# Altium project Breakout_for_ics4343.PrjPcb
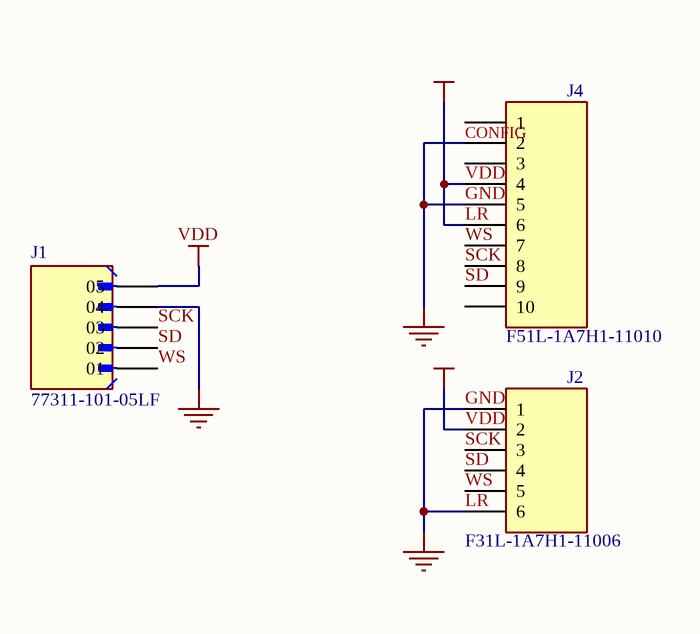
[diagram p0: Breakout_for_ics4343.SchDoc]
1 sheet, 3 parts. Net scope: global (net labels, ports and power ports of the same name join across sheets).
Board file: Breakout_for_ics4343.PcbDoc

## Sheet Breakout_for_ics4343.SchDoc
size 149 x 90 mm; SheetNumber: 1; SheetTotal: 1

### Parts
J1  77311-101-05LF  [AMPHENOL_77311-101-05LF]
J2  F31L-1A7H1-11006  [AMPHENOL_F31L-1A7H1-11006]
J4  F51L-1A7H1-11010  [AMPHENOL_F51L-1A7H1-11010]

### Nets
GND: J1.04 J2.1 J2.6 J4.2 J4.5
VDD: J1.05 J2.2 J4.4 J4.6
SCK: J1.03 J2.3 J4.8
SD: J1.02 J2.4 J4.9
WS: J1.01 J2.5 J4.7

Not connected (* = marked no-connect by the designer): J4 1 3 10

### Notes on the sheet
- (near J4) CONFIG
- (near J4) LR
- (near J4) VDD
- (near J4) GND
- (near J2) VDD
- (near J2) GND
- (near J2) LR

### Library data of the parts
J1 = 77311-101-05LF: MF: Amphenol; Package: None; Price: None; Value: *; MP: 77311-101-05LF; Availability: Unavailable
J2 = F31L-1A7H1-11006: Flex Connector, 0.50mm Pitch, Height 2.55mm, Right angle, Flip type, ZIF, 6 position , With MYLAR; MF: Amphenol ICC (FCI); Package: None; Price: None; Check_prices: https://www.snapeda.com/parts/F31L-1A7H1-11006/Amphenol+FCI/view-part/?ref=eda; Value: *; SnapEDA_Link: https://www.snapeda.com/parts/F31L-1A7H1-11006/Amphenol+FCI/view-part/?ref=snap; MP: F31L-1A7H1-11006; Availability: In Stock; Purchase-URL: https://pricing.snapeda.com/search?q=F31L-1A7H1-11006&ref=eda; Supplier: Mouser; Supplier Part Number: 538-22-28-4063
J4 = F51L-1A7H1-11010: Flex Connector, 1.00mm Pitch, Height 2.55mm, Right angle, Flip type, ZIF, 10 position , With MYLAR; MF: Amphenol ICC (FCI); Package: None; Price: None; Check_prices: https://www.snapeda.com/parts/F51L-1A7H1-11010/Amphenol+FCI/view-part/?ref=eda; Value: *; SnapEDA_Link: https://www.snapeda.com/parts/F51L-1A7H1-11010/Amphenol+FCI/view-part/?ref=snap; MP: F51L-1A7H1-11010; Availability: In Stock; Purchase-URL: https://pricing.snapeda.com/search?q=F51L-1A7H1-11010&ref=eda